# EAGLE design tC-mcu-adapter-rev1 (EAGLE 7.2.0)
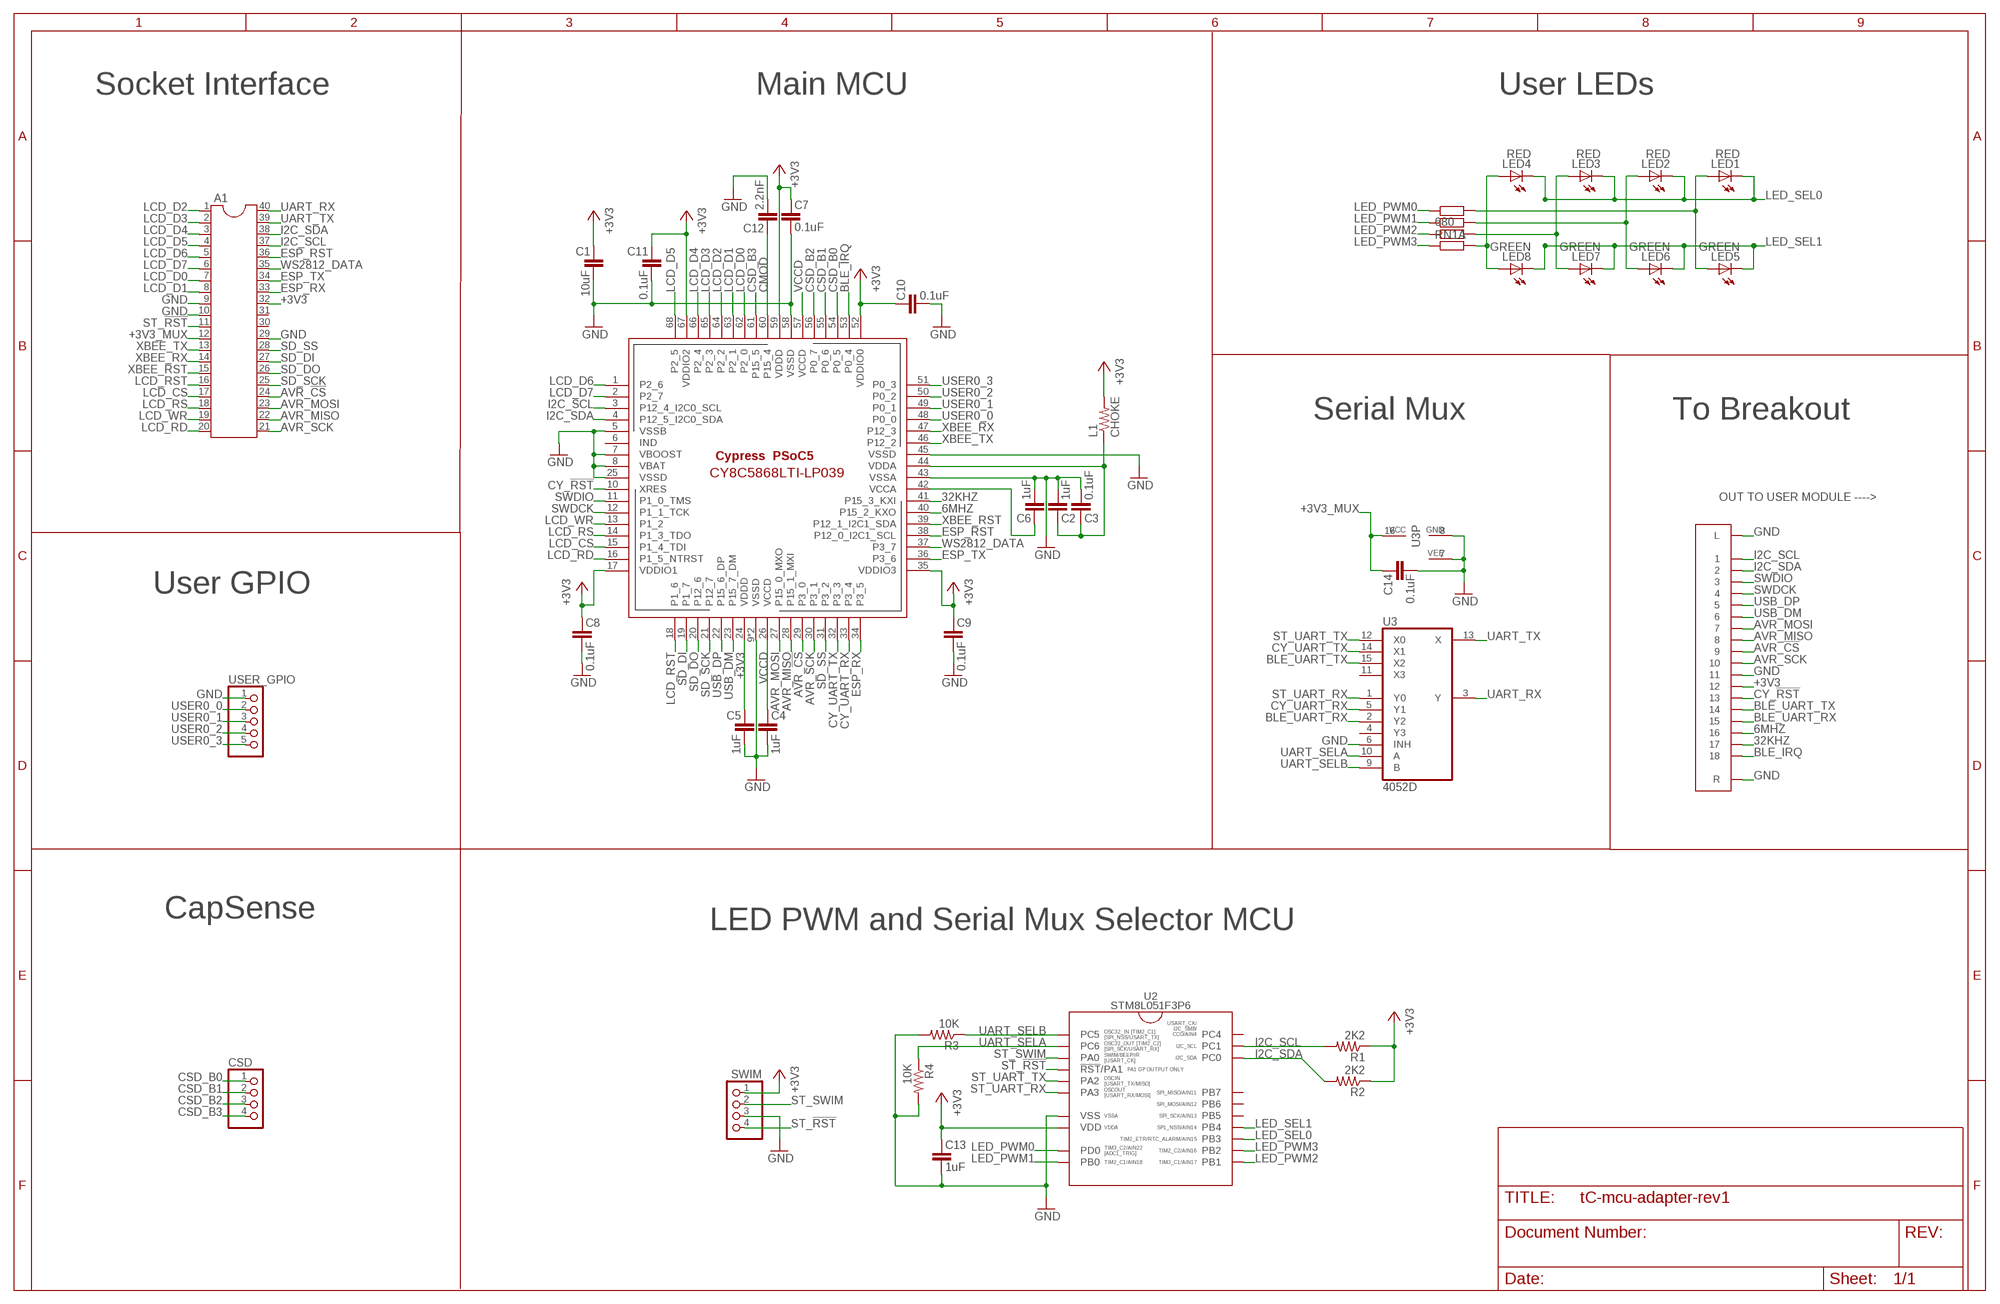
[diagram p0: schematic, sheet 1]

## Parts
A1  DIL40  [DIL40]
C1  10uF  C-EUC0805K  [C0805K]
C2  1uF  C-EUC0603K  [C0603K]
C3  0.1uF  C-EUC0603K  [C0603K]
C4  1uF  C-EUC0603K  [C0603K]
C5  1uF  C-EUC0603K  [C0603K]
C6  1uF  C-EUC0603K  [C0603K]
C7  0.1uF  C-EUC0603K  [C0603K]
C8  0.1uF  C-EUC0603K  [C0603K]
C9  0.1uF  C-EUC0603K  [C0603K]
C10  0.1uF  C-EUC0603K  [C0603K]
C11  0.1uF  C-EUC0603K  [C0603K]
C12  2.2nF  C-EUC0603K  [C0603K]
C13  1uF  C-EUC0402K  [C0402K]
C14  0.1uF  C-EUC0402K  [C0402K]
CN1  FPC_CONN_18PIN_0.5MM_SMT  [FPC_CONN_18PIN_0.5MM_SMT]
CSD  CAP_INTERCONNECT  [CAP_INTERCONNECT]
L1  CHOKE  R-US_R0805  [R0805]
LED1  RED  LED-0805  [LED-805]
LED2  RED  LED-0805  [LED-805]
LED3  RED  LED-0805  [LED-805]
LED4  RED  LED-0805  [LED-805]
LED5  GREEN  LED-0805  [LED-805]
LED6  GREEN  LED-0805  [LED-805]
LED7  GREEN  LED-0805  [LED-805]
LED8  GREEN  LED-0805  [LED-805]
R1  2K2  R-US_R0603  [R0603]
R2  2K2  R-US_R0603  [R0603]
R3  10K  R-US_R0603  [R0603]
R4  10K  R-US_R0603  [R0603]
RN1  680  RESISTOR_ARRAY_4  [RN8P-4R-CRA06S]
SWIM  PINHD-1X4  [1X04]
U1  CY8C5XXX-68-N  [QFN68N]
U2  STM8L051F3P6  [TSSOP20]
U3  4052D  [SO16]
USER_GPIO  PINHD-1X5/90  [1X05/90]

## Nets
6MHZ: CN1.16 U1.40(P15_2_KXO)
32KHZ: CN1.17 U1.41(P15_3_KXI)
+3V3: A1.32 C1.1 C5.1 C7.1 C8.1 C9.1 C10.1 C11.1 C13.1 CN1.12 L1.2 R1.1 R2.1 SWIM.1 U1.17(VDDIO1) U1.24(VDDD) U1.35(VDDIO3) U1.52(VDDIO0) U1.59(VDDD) U1.67(VDDIO2) U2.8(VDD)
+3V3_MUX: A1.12 C14.1 U3.16(VCC)
AVR_!CS: A1.24 CN1.9 U1.29(P3_0)
AVR_MISO: A1.22 CN1.8 U1.28(P15_1_MXI)
AVR_MOSI: A1.23 CN1.7 U1.27(P15_0_MXO)
AVR_SCK: A1.21 CN1.10 U1.30(P3_1)
BLE_IRQ: CN1.18 U1.53(P0_4)
BLE_UART_RX: CN1.15 U3.2(Y2)
BLE_UART_TX: CN1.14 U3.15(X2)
CMOD: C12.1 U1.60(P15_4)
CSD_B0: CSD.1 U1.54(P0_5)
CSD_B1: CSD.2 U1.55(P0_6)
CSD_B2: CSD.3 U1.56(P0_7)
CSD_B3: CSD.4 U1.61(P15_5)
CY_!RST: CN1.13 U1.10(XRES)
CY_UART_RX: U1.33(P3_4) U3.5(Y1)
CY_UART_TX: U1.32(P3_3) U3.14(X1)
ESP_RST: A1.36 U1.38(P12_0_I2C1_SCL)
ESP_RX: A1.33 U1.34(P3_5)
ESP_TX: A1.34 U1.36(P3_6)
GND: A1.9 A1.10 A1.29 C1.2 C2.2 C3.2 C4.2 C5.2 C6.2 C7.2 C8.2 C9.2 C10.2 C11.2 C12.2 C13.2 C14.2 CN1.11 CN1.GL(L) CN1.GR(R) R3.2 R4.2 SWIM.3 U1.5(VSSB) U1.7(VBOOST) U1.8(VBAT) U1.9(VSSD) U1.25(VSSD) U1.43(VSSA) U1.45(VSSD) U1.58(VSSD) U1.EPAD(VSSD) U2.7(VSS) U3.6(INH) U3.7(VEE) U3.8(GND) USER_GPIO.1
I2C_SCL: A1.37 CN1.1 R1.2 U1.3(P12_4_I2C0_SCL) U2.19(PC1)
I2C_SDA: A1.38 CN1.2 R2.2 U1.4(P12_5_I2C0_SDA) U2.18(PC0)
LCD_CS: A1.17 U1.15(P1_4_TDI)
LCD_D0: A1.7 U1.62(P2_0)
LCD_D1: A1.8 U1.63(P2_1)
LCD_D2: A1.1 U1.64(P2_2)
LCD_D3: A1.2 U1.65(P2_3)
LCD_D4: A1.3 U1.66(P2_4)
LCD_D5: A1.4 U1.68(P2_5)
LCD_D6: A1.5 U1.1(P2_6)
LCD_D7: A1.6 U1.2(P2_7)
LCD_RD: A1.20 U1.16(P1_5_NTRST)
LCD_RS: A1.18 U1.14(P1_3_TDO)
LCD_RST: A1.16 U1.18(P1_6)
LCD_WR: A1.19 U1.13(P1_2)
LED_PWM0: RN1.4 U2.9(PD0)
LED_PWM0R: LED1.A LED5.A RN1.5
LED_PWM1: RN1.3 U2.10(PB0)
LED_PWM1R: LED2.A LED6.A RN1.6
LED_PWM2: RN1.2 U2.11(PB1)
LED_PWM2R: LED3.A LED7.A RN1.7
LED_PWM3: RN1.1 U2.12(PB2)
LED_PWM3R: LED4.A LED8.A RN1.8
LED_SEL0: LED1.C LED2.C LED3.C LED4.C U2.13(PB3)
LED_SEL1: LED5.C LED6.C LED7.C LED8.C U2.14(PB4)
SD_DI: A1.27 U1.19(P1_7)
SD_DO: A1.26 U1.20(P12_6)
SD_SCK: A1.25 U1.21(P12_7)
SD_SS: A1.28 U1.31(P3_2)
ST_!RST: A1.11 SWIM.4 U2.4(!RST!/PA1)
ST_SWIM: SWIM.2 U2.3(PA0)
ST_UART_RX: U2.6(PA3) U3.1(Y0)
ST_UART_TX: U2.5(PA2) U3.12(X0)
SWDCK: CN1.4 U1.12(P1_1_TCK)
SWDIO: CN1.3 U1.11(P1_0_TMS)
UART_RX: A1.40 U3.3(Y)
UART_SELA: R4.1 U2.2(PC6) U3.10(A)
UART_SELB: R3.1 U2.1(PC5) U3.9(B)
UART_TX: A1.39 U3.13(X)
USB_DM: CN1.6 U1.23(P15_7_DM)
USB_DP: CN1.5 U1.22(P15_6_DP)
USER0_0: U1.48(P0_0) USER_GPIO.2
USER0_1: U1.49(P0_1) USER_GPIO.3
USER0_2: U1.50(P0_2) USER_GPIO.4
USER0_3: U1.51(P0_3) USER_GPIO.5
VCCA: C6.1 U1.42(VCCA)
VCCD: C4.1 U1.26(VCCD) U1.57(VCCD)
VDDA: C2.1 C3.1 L1.1 U1.44(VDDA)
WS2812_DATA: A1.35 U1.37(P3_7)
XBEE_RST: A1.15 U1.39(P12_1_I2C1_SDA)
XBEE_RX: A1.14 U1.47(P12_3)
XBEE_TX: A1.13 U1.46(P12_2)
Unconnected: A1.30 A1.31 U1.6(IND) U2.15(PB5) U2.16(PB6) U2.17(PB7) U2.20(PC4) U3.4(Y3) U3.11(X3)

## Notes on the sheet
- Socket Interface | Main MCU | User LEDs
- Serial Mux | To Breakout
- OUT TO USER MODULE ---->
- User GPIO
- CapSense
- LED PWM and Serial Mux Selector MCU

## Library data of the parts
A1 = _dc801:DIL40: Dual In Line
C1-C14 = rcl:C-EU: CAPACITOR, European symbol
CN1 = _dc801:FPC_CONN_18PIN
CSD = _dc801:CAP_INTERCONNECT
L1 R1-R4 = rcl:R-US_: RESISTOR, American symbol
LED1-LED8 = _wp_dc23:LED: Light Emitting Diode
RN1 = _dc801:RESISTOR_ARRAY_4: 4 Resistor Array 0603
SWIM = _dc801:PINHD-1X4: PIN HEADER
U1 = PatternAgents-Cypress:CY8C5XXX-68: Cypress PSoC® 5 - Programmable System on Chip, ARM Cortex-M3 Based Source Data: http://www.cypress.com/?mpn=CY8C5868LTI-LP038 PKG Source: http://www.cypress.com/?docID=38892 LBR Source: http://www.patternagents.com THIS SOFTWARE IS PROVIDED BY THE CONTRIBUTORS "AS IS" AND WITHOUT ANY EXPRESS OR IMPLIED WARRANTIES, INCLUDING, BUT NOT LIMITED TO, THE IMPLIED WARRANTIES OF MERCHANTABILITY AND FITNESS FOR A PARTICULAR PURPOSE ARE DISCLAIMED. IN NO EVENT SHALL THE COPYRIGHT OWNER OR CONTRIBUTORS BE LIABLE FOR ANY DIRECT, INDIRECT, INCIDENTAL, SPECIAL, EXEMPLARY, OR CONSEQUENTIAL DAMAGES (INCLUDING, BUT NOT LIMITED TO, PROCUREMENT OF SUBSTITUTE GOODS OR SERVICES; LOSS OF USE, DATA, OR PROFITS; OR BUSINESS INTERRUPTION) HOWEVER CAUSED AND ON ANY THEORY OF LIABILITY, WHETHER IN CONTRACT, STRICT LIABILITY, OR TORT (INCLUDING NEGLIGENCE OR OTHERWISE) ARISING IN ANY WAY OUT OF THE USE OF THIS SOFTWARE, EVEN IF ADVISED OF THE POSSIBILITY OF SUCH DAMAGE.
U2 = _wp_dc23:STM8L
U3 = 40xx:4052: Dual 4-channel ANALOG MULTIPLEXER
USER_GPIO = pinhead:PINHD-1X5: PIN HEADER

## Board
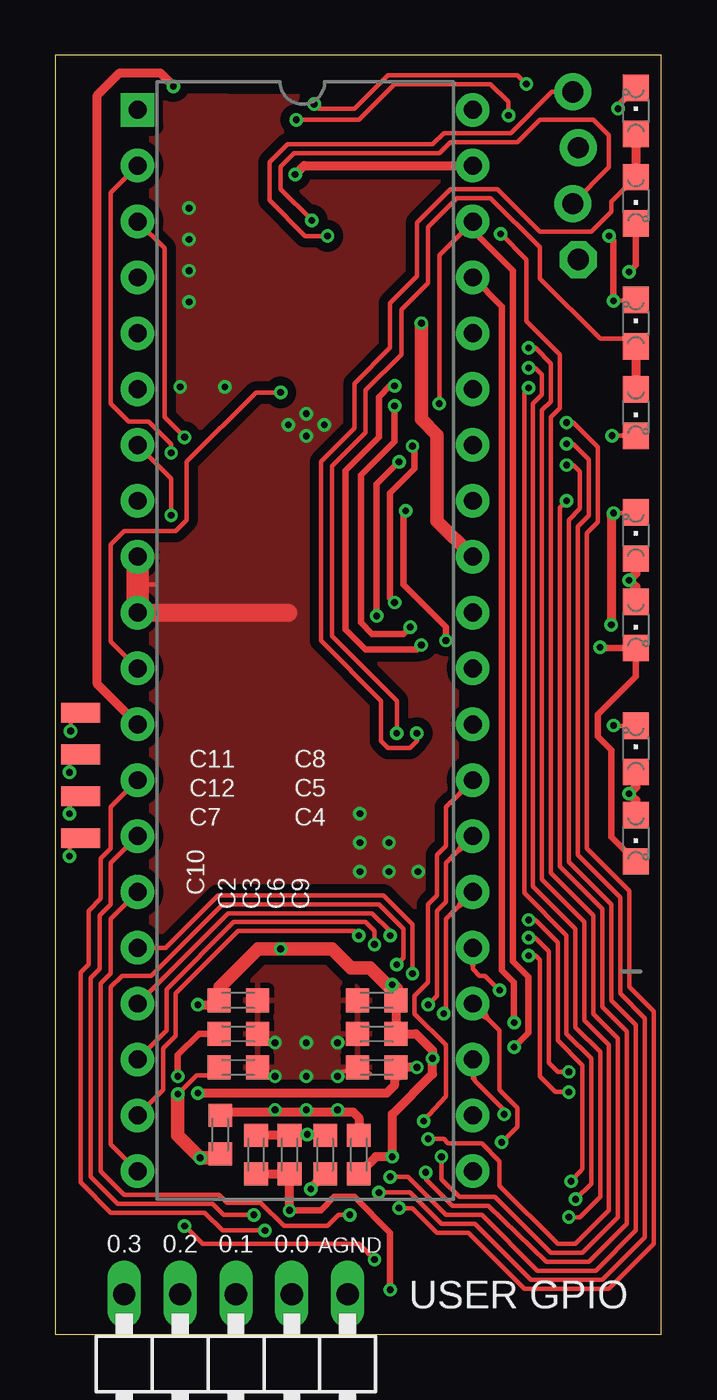
[diagram p1: board, top side]
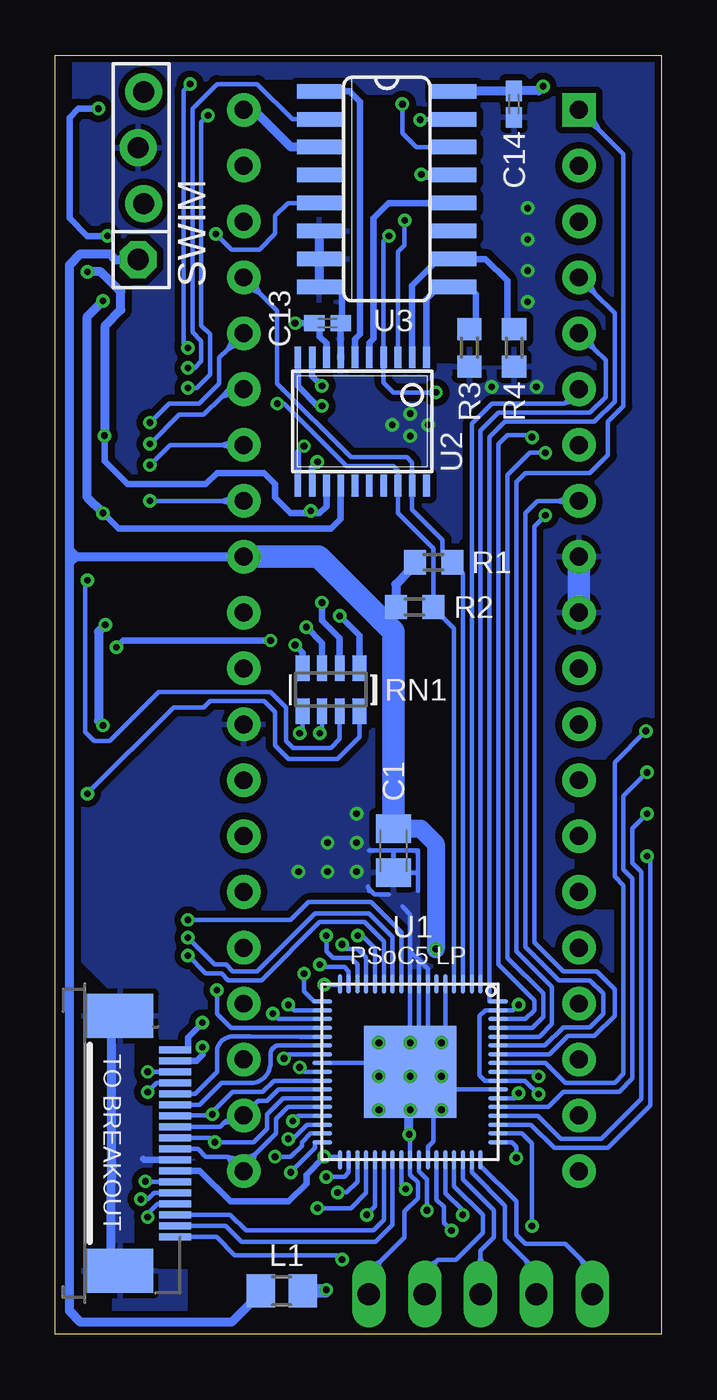
[diagram p2: board, bottom side, seen from below]

Size 27.58 x 58.17 mm. Coordinates in mm from the lower left corner, seen from the top.
Outline: 0,0 27.58,0 27.58,58.17 0,58.17 0,0
Copper layers (1*16): Top 0.035mm / dielectric 1.5mm / Bottom 0.035mm
Design rules "Elecrow2LAYER *": minimum track width 6mil, minimum drill 12mil, track to track 7mil, track to pad 7mil, pad to pad 6mil, via to via 6mil, smd to smd 0mil, copper to edge 10mil, drill to drill 10mil, minimum pad ring 10mil, minimum via ring 6mil, stop-mask expansion 2mil, vias tented up to drill 100mil, thermal gap 10mil
bRestrict: 20 lines

### Footprints (pad centres in the part's own frame; a part is rotated, then mirrored left to right if it is on the bottom)
DIL40 = drill 0.813 pad 1.524 square: 1 -24.13,-7.62 | drill 0.813 pad 1.524: 2 -21.59,-7.62; 3 -19.05,-7.62; 4 -16.51,-7.62; 5 -13.97,-7.62; 6 -11.43,-7.62; 7 -8.89,-7.62; 8 -6.35,-7.62; 9 -3.81,-7.62; 10 -1.27,-7.62; 11 1.27,-7.62; 12 3.81,-7.62; 13 6.35,-7.62; 14 8.89,-7.62; 15 11.43,-7.62; 16 13.97,-7.62; 17 16.51,-7.62; 18 19.05,-7.62; 19 21.59,-7.62; 20 24.13,-7.62; 21 24.13,7.62; 22 21.59,7.62; 23 19.05,7.62; 24 16.51,7.62; 25 13.97,7.62; 26 11.43,7.62; 27 8.89,7.62; 28 6.35,7.62; 29 3.81,7.62; 30 1.27,7.62; 31 -1.27,7.62; 32 -3.81,7.62; 33 -6.35,7.62; 34 -8.89,7.62; 35 -11.43,7.62; 36 -13.97,7.62; 37 -16.51,7.62; 38 -19.05,7.62; 39 -21.59,7.62; 40 -24.13,7.62
C0805K = smd 1.3 x 1.6: 1 -1,0; 2 1,0
C0603K = smd 1.05 x 1.08: 1 -0.875,0; 2 0.875,0
C0402K = smd 0.925 x 0.74: 1 -0.6,0; 2 0.6,0
FPC_CONN_18PIN_0.5MM_SMT = smd 0.3 x 1.45: 1 -4.25,4.1; 2 -3.75,4.1; 3 -3.25,4.1; 4 -2.75,4.1; 5 -2.25,4.1; 6 -1.75,4.1; 7 -1.25,4.1; 8 -0.75,4.1; 9 -0.25,4.1; 10 0.25,4.1; 11 0.75,4.1; 12 1.25,4.1; 13 1.75,4.1; 14 2.25,4.1; 15 2.75,4.1; 16 3.25,4.1; 17 3.75,4.1; 18 4.25,4.1 | smd 2 x 3: GL 5.8,1.6; GR -5.8,1.6
CAP_INTERCONNECT = smd 0.889 x 1.778: 1 0,0; 2 1.905,0; 3 3.81,0; 4 5.715,0
R0805 = smd 1.3 x 1.5: 1 -0.95,0; 2 0.95,0
LED-805 = smd 1.2 x 1.2: A 0,-1.05; C 0,1.05
R0603 = smd 1 x 1.1: 1 -0.85,0; 2 0.85,0
RN8P-4R-CRA06S = smd 0.63 x 1.15: 1 -1.295,-0.975; 4 1.295,-0.975; 5 1.295,0.975; 8 -1.295,0.975 | smd 0.44 x 1.15: 2 -0.4,-0.975; 3 0.4,-0.975; 6 0.4,0.975; 7 -0.4,0.975
1X04 = drill 0.965 pad 1.676 octagon: 1 -3.81,0.127 | drill 0.965 pad 1.676: 2 -1.27,-0.127; 3 1.27,0.127; 4 3.81,-0.127
QFN68N = smd 0.9 x 0.2: 1 -4,3.2; 2 -4,2.8; 3 -4,2.4; 4 -4,2; 5 -4,1.6; 6 -4,1.2; 7 -4,0.8; 8 -4,0.4; 9 -4,0; 10 -4,-0.4; 11 -4,-0.8; 12 -4,-1.2; 13 -4,-1.6; 14 -4,-2; 15 -4,-2.4; 16 -4,-2.8; 17 -4,-3.2; 35 4,-3.2; 36 4,-2.8; 37 4,-2.4; 38 4,-2; 39 4,-1.6; 40 4,-1.2; 41 4,-0.8; 42 4,-0.4; 43 4,0; 44 4,0.4; 45 4,0.8; 46 4,1.2; 47 4,1.6; 48 4,2; 49 4,2.4; 50 4,2.8; 51 4,3.2 | smd 0.2 x 0.9: 18 -3.2,-4; 19 -2.8,-4; 20 -2.4,-4; 21 -2,-4; 22 -1.6,-4; 23 -1.2,-4; 24 -0.8,-4; 25 -0.4,-4; 26 0,-4; 27 0.4,-4; 28 0.8,-4; 29 1.2,-4; 30 1.6,-4; 31 2,-4; 32 2.4,-4; 33 2.8,-4; 34 3.2,-4; 52 3.2,4; 53 2.8,4; 54 2.4,4; 55 2,4; 56 1.6,4; 57 1.2,4; 58 0.8,4; 59 0.4,4; 60 0,4; 61 -0.4,4; 62 -0.8,4; 63 -1.2,4; 64 -1.6,4; 65 -2,4; 66 -2.4,4; 67 -2.8,4; 68 -3.2,4 | smd 4.2 x 4.2: EPAD 0,0
TSSOP20 = smd 0.305 x 0.991: 1 -2.925,-2.918; 2 -2.275,-2.918; 3 -1.625,-2.918; 4 -0.975,-2.918; 5 -0.325,-2.918; 6 0.325,-2.918; 7 0.975,-2.918; 8 1.625,-2.918; 9 2.275,-2.918; 10 2.925,-2.918; 11 2.925,2.918; 12 2.275,2.918; 13 1.625,2.918; 14 0.975,2.918; 15 0.325,2.918; 16 -0.325,2.918; 17 -0.975,2.918; 18 -1.625,2.918; 19 -2.275,2.918; 20 -2.925,2.918
SO16 = smd 0.66 x 2.032: 1 -4.445,-3.073; 2 -3.175,-3.073; 3 -1.905,-3.073; 4 -0.635,-3.073; 5 0.635,-3.073; 6 1.905,-3.073; 7 3.175,-3.073; 8 4.445,-3.073; 9 4.445,3.073; 10 3.175,3.073; 11 1.905,3.073; 12 0.635,3.073; 13 -0.635,3.073; 14 -1.905,3.073; 15 -3.175,3.073; 16 -4.445,3.073
1X05/90 = drill 1.016 long: 1 -5.08,-3.81; 2 -2.54,-3.81; 3 0,-3.81; 4 2.54,-3.81; 5 5.08,-3.81

### Placement (x,y rotation side)
A1  11.38,31.55 270 top
C1  12.19,22 270 bottom
C2  9.14,8.18 90 top
C3  10.67,8.18 90 top
C4  14.63,12.14 180 top
C5  14.63,13.67 180 top
C6  12.29,8.18 90 top
C7  8.33,12.14 0 top
C8  14.63,15.19 180 top
C9  13.82,8.18 90 top
C10  7.52,9.09 90 top
C11  8.33,15.19 0 top
C12  8.33,13.67 0 top
C13  15.19,45.97 0 bottom
C14  6.72,55.93 270 bottom
CN1  26.21,8.69 270 bottom
CSD  1.17,22.56 90 top
L1  17.27,1.98 180 bottom
LED1  26.42,51.56 180 top
LED2  26.42,41.91 180 top
LED3  26.42,32.26 180 top
LED4  26.42,22.56 180 top
LED5  26.42,55.63 0 top
LED6  26.42,45.97 0 top
LED7  26.42,36.32 0 top
LED8  26.42,26.62 0 top
R1  10.36,35.1 0 bottom
R2  11.23,33.07 0 bottom
R3  8.74,44.86 270 bottom
R4  6.71,44.86 270 bottom
RN1  15.04,29.31 180 bottom
SWIM  23.67,52.68 90 bottom
U1  11.43,11.94 270 bottom
U2  13.61,41.5 180 bottom
U3  12.5,52.07 270 bottom
USER_GPIO  8.23,-1.98 180 top

### Tracks (layer width: path | path; a pad name or v marks a point on that pad's centre or on a via)
6MHZ
  Bottom 0.203: U1.40 12.63,5.2 13.11,4.72 18.9,4.72 19.61,5.44 CN1.16
32KHZ
  Bottom 0.203: U1.41 12.23,4.99 13.01,4.22 19.1,4.22 19.82,4.94 CN1.17
+3V3  (via drill 0.3)
  Top 0.203: v5.59,10.92 6.45,11.79 7.1,11.79 C7.1
  Top 0.406: 15.65,13.36 C5.1 | v6.5,14.99 7.33,14.99 C11.1 | C5.1 16.41,13.66 17.17,12.9 v17.17,12.55 | C8.1 C5.1 | 17.27,12.55 v17.17,12.55 | v17.17,12.55 17.17,11.84 15.34,10.01 v15.34,8.08 14.59,8.08 C9.1
  Top 0.61: C11.1 7.52,14.98 7.52,15.8 9.25,17.53 v10.26,17.53 12.6,17.53 13.46,16.66 14.33,16.66 15.09,15.9 v15.34,15.9 15.54,15.71 C8.1 | A1.32 17.37,36.98 17.37,40.89 16.66,41.6 v16.66,45.97 | v5.59,10.92 5.59,9.04 v6.6,8.03 7.53,8.03 C10.1
  Bottom 0.203: v15.34,15.9 14.63,15.9 U1.17 | U1.35 14.63,8.08 v15.34,8.08 | v6.5,14.99 6.75,14.74 U1.67 8.02,14.74 8.28,14.48 8.28,11.79 8.03,11.54 U1.59 6.2,11.54 v5.59,10.92 | U1.24 16.98,12.74 v17.17,12.55 | R2.1 12.65,32.5 12.65,32.41 | U1.52 6.81,8.74 6.6,8.53 v6.6,8.03
  Bottom 0.305: v15.34,8.08 16.15,7.26 16.15,6.86 16.97,6.04 19.61,6.04 21,7.44 CN1.12 | U2.8 15.24,45.06 15.54,45.36 15.54,45.63 C13.1 v16.66,45.97
  Bottom 0.406: L1.2 18.64,1.56 18.64,1.47 19.56,0.56 26.42,0.56 26.92,1.07 26.92,35.1 | 26.92,35.1 26.92,35.36 | 26.92,35.36 26.92,35.66 | 26.92,35.36 26.62,35.36 | 26.62,35.36 A1.32 | 26.62,35.36 26.92,35.66 | 26.62,35.36 26.92,35.1 | R1.1 11.48,34.73 11.48,34.7 12.08,34.1 R2.1 | 26.92,35.66 26.92,48.62 26.42,49.12 25.09,49.12 24.84,48.87 SWIM.1
  Bottom 0.813: C1.1 10.96,23 10.26,22.3 v10.26,17.53
  Bottom 1.016: C1.1 12.19,31.95 12.65,32.41 15.6,35.36 A1.32
+3V3_MUX  (via drill 0.3)
  Top 0.406: A1.12 1.93,29.57 1.93,56.34 2.95,57.35 4.78,57.35 v5.38,56.74
  Bottom 0.406: v5.38,56.74 5.6,56.53 C14.1 6.73,56.52 U3.16
AVR_!CS  (via drill 0.3)
  Top 0.203: 19.66,14.38 20.22,13.82 20.22,11.12 21.03,10.31 21.03,9.45 v20.32,8.74 | 19.66,14.38 A1.24 | 19.66,14.38 19.46,14.83 | 19.66,14.38 19.15,14.63
  Bottom 0.203: U1.29 17.2,10.74 17.93,10.01 17.93,9.35 18.54,8.74 v20.32,8.74 20.52,8.94 CN1.9
AVR_MISO
  Bottom 0.203: U1.28 17.41,11.14 17.93,10.62 18.34,10.62 A1.22 19.25,9.7 19.41,9.7 | 19.91,9.6 20.08,9.44 CN1.8 | 19.91,9.6 19.81,9.7 | 19.81,9.7 19.41,9.7 | 19.91,9.6 19.41,9.7 | 19.81,9.7 19.51,9.91
AVR_MOSI  (via drill 0.3)
  Top 0.203: A1.23 19,11.94 | 19,11.94 19,11.63 19.1,11.53 | v20.42,10.01 20.42,10.21 19.1,11.53 | 19.1,11.53 19,11.94
  Bottom 0.203: U1.27 17.62,11.54 18.14,11.02 19.51,11.02 20.42,10.11 v20.42,10.01 20.47,9.96 22.09,9.96 CN1.7
AVR_SCK
  Bottom 0.203: U1.30 16.99,10.34 17.53,9.8 17.53,9.14 18.49,8.18 | 18.49,8.18 19,7.67 A1.21 19.05,7.42 19.71,8.08 | 19.71,8.08 20.73,8.08 21.09,8.44 CN1.10 | 18.49,8.18 18.59,7.77 | 18.49,8.18 19,7.98 | 19.71,8.08 19.51,7.67 | 19.71,8.08 19.3,7.98
BLE_IRQ  (via drill 0.3)
  Top 0.203: v14.53,3.4 13.82,4.12 6.71,4.12 v5.89,4.93
  Bottom 0.203: 21.54,4.42 22.1,4.42 CN1.18 20.24,4.44 19.41,3.61 14.73,3.61 v14.53,3.4 | 6.95,9.14 U1.53 6.34,9.14 5.89,8.69 v5.89,4.93
BLE_UART_RX  (via drill 0.3)
  Top 0.203: v23.37,5.33 23.88,5.33 24.79,6.25 24.79,12.85 23.67,13.97 23.67,18.44 21.74,20.37 21.74,42.32 22.15,42.72 22.15,43.64 21.84,43.94 v21.54,43.94
  Bottom 0.203: v23.37,5.33 23.37,5.49 22.92,5.94 CN1.15 | v21.54,43.94 21.23,43.94 20.93,44.25 20.93,45.16 21.34,45.57 21.34,55.73 20.22,56.84 18.39,56.84 16.79,55.24 U3.2
BLE_UART_TX  (via drill 0.3)
  Top 0.203: v23.67,6.15 24.38,6.86 24.38,12.55 23.27,13.66 23.27,18.14 21.34,20.07 21.34,42.82 v21.54,43.03 | v20.62,55.42 20.62,56.03 19.81,56.84 15.44,56.84 13.82,55.22 v10.97,55.22
  Bottom 0.203: v23.67,6.15 23.37,6.15 23.08,6.44 CN1.14 | v21.54,43.03 21.13,43.03 20.52,43.64 20.52,45.47 20.93,45.87 20.93,55.12 v20.62,55.42 | v10.97,55.22 10.95,55.24 U3.15
CMOD  (via drill 0.3)
  Top 0.305: v5.59,11.73 5.59,12.7 6.55,13.66 C12.1
  Top 0.406: 7.21,13.36 C12.1
  Bottom 0.203: v5.59,11.73 5.79,11.94 U1.60
CSD_B0  (via drill 0.3 pad 0.25)
  Top 0.203: 0.51,22.35 0.61,22.45 0.66,22.45 | 1.07,22.45 CSD.1 0.66,22.55 0.66,22.45 | v0.66,21.74 0.66,22.45
  Bottom 0.203: U1.54 5.93,9.54 4.88,8.48 2.44,8.48 0.51,10.41 0.51,21.59 v0.66,21.74
CSD_B1  (via drill 0.3)
  Top 0.203: v0.66,23.67 0.66,24.46 CSD.2
  Bottom 0.203: U1.55 5.62,9.94 4.57,8.89 2.74,8.89 0.91,10.72 0.91,21.03 1.32,21.44 1.32,23.01 v0.66,23.67
CSD_B2  (via drill 0.3)
  Top 0.203: v0.66,25.55 0.66,26.36 CSD.3
  Bottom 0.203: U1.56 5.16,10.34 4.47,11.02 1.93,11.02 1.32,11.63 1.32,20.73 1.73,21.13 1.73,24.49 v0.66,25.55
CSD_B3  (via drill 0.3)
  Top 0.203: v0.71,27.43 0.71,28.27 CSD.4
  Bottom 0.203: U1.61 5.28,12.34 4.37,11.43 2.13,11.43 1.73,11.84 1.73,20.42 2.13,20.83 2.13,26.01 v0.71,27.43
CY_!RST  (via drill 0.3)
  Top 0.203: v23.47,6.96 23.93,7.47 23.98,7.52 23.98,12.24 22.86,13.36 22.86,17.83 21.84,18.85 v21.54,18.85
  Bottom 0.203: v21.54,18.85 16.87,18.85 16.05,19.66 13.21,19.66 11.83,18.28 U1.10 | v23.47,6.96 23.45,6.94 CN1.13
CY_UART_RX  (via drill 0.3)
  Top 0.203: v17.58,8.08 17.58,7.06 18.39,6.25 20.02,6.25 22.55,3.71 23.98,3.71 25.6,5.33 25.6,13.46 24.49,14.58 24.49,19.05 22.55,20.98 22.55,41.71 22.96,42.11 22.96,44.55 21.44,46.08 21.44,48.87 v20.27,50.04
  Bottom 0.203: U1.33 15.96,9.14 16.36,8.74 16.36,8.59 16.87,8.08 v17.58,8.08 | v20.27,50.04 19.56,49.33 18.29,49.33 17.58,50.04 17.58,50.85 16.99,51.44 U3.5
CY_UART_TX  (via drill 0.3)
  Top 0.203: v16.97,8.89 17.68,8.89 17.88,8.69 19.41,8.69 20.22,7.87 20.22,6.76 22.86,4.12 23.67,4.12 25.2,5.64 25.2,13.16 24.08,14.28 24.08,18.75 22.15,20.68 22.15,42.01 22.55,42.42 22.55,44.15 21.84,44.86 v21.54,44.86 | v11.79,55.93 11.99,55.73 13.61,55.73 15.14,57.25 21.03,57.25 v21.44,56.84
  Bottom 0.203: U1.32 16.12,9.54 16.76,8.89 v16.97,8.89 | U3.14 11.15,53.98 11.79,54.61 v11.79,55.93 | v21.44,56.84 21.74,56.54 21.74,45.06 v21.54,44.86
ESP_RST  (via drill 0.3)
  Top 0.203: v15.65,5.74 16.26,5.74 17.37,4.62 18.8,4.62 21.34,2.08 25.2,2.08 27.23,4.12 27.23,14.68 26.11,15.8 26.11,20.17 24.18,22.1 24.18,36.42 24.69,36.93 24.69,40.34 23.57,41.45 v23.27,41.45
  Bottom 0.203: U1.38 13.43,6.43 14.12,5.74 v15.65,5.74 | A1.36 19.71,44.81 | 19.71,44.81 20.12,44.4 20.12,43.23 21.03,42.32 22.4,42.32 v23.27,41.45 | 19.71,44.81 19.46,45.31 | 19.71,44.81 19.2,45.06
ESP_RX  (via drill 0.3)
  Top 0.203: v23.27,37.9 22.96,37.59 22.96,21.29 24.89,19.36 24.89,14.88 26.01,13.77 26.01,5.03 24.28,3.3 22.35,3.3 19.71,5.84 18.09,5.84 16.87,7.06 v16.87,7.37
  Bottom 0.203: U1.34 15.7,8.74 15.75,8.69 15.75,8.48 v16.87,7.37 | v23.27,37.9 20.02,37.9 | 20.02,37.9 A1.33 | 20.02,37.9 19.51,38.05 | 20.02,37.9 19.51,37.74
ESP_TX  (via drill 0.3)
  Top 0.203: v15.24,7.16 16.05,7.16 17.78,5.44 19.41,5.44 21.95,2.9 24.59,2.9 26.42,4.72 26.42,14.07 25.3,15.19 25.3,19.56 23.37,21.49 23.37,37.03 23.88,37.54 23.88,39.22 23.57,39.52 v23.27,39.52
  Bottom 0.203: U1.36 14.23,7.36 14.43,7.16 v15.24,7.16 | v23.27,39.52 22.35,40.44 20.02,40.44 | 20.02,40.44 A1.34 | 20.02,40.44 19.51,40.59 | 20.02,40.44 19.51,40.28
GND  (via drill 0.3)
  Top 0.203: 14.33,11.84 C4.2 12.75,11.84 v12.85,11.73 | v12.85,10.21 12.85,10.16 12.9,10.11 | 3.76,34.09 4.57,34.09
  Top 0.406: C2.2 C3.2 v11.47,9.08 v11.48,9.09 12.28,9.09 | 7.57,10.26 7.72,10.11 12.9,10.11 13.56,10.11 13.82,9.86 C9.2
  Top 0.61: C10.2 7.72,10.11 | 12.28,9.09 C6.2
  Top 0.813: A1.10 10.62,32.82
  Top 1.016: A1.10 3.76,34.09 3.76,35.31
  Bottom 0.203: U1.58 10.36,11.14 | 10.36,11.14 10.57,11.14 | 10.57,11.14 10.63,11.14 11.05,11.56 U1.EPAD | v11.48,9.09 11.43,9.14 U1.43 11.43,7.26 11.07,6.91 11.07,6.2 11.68,5.59 11.68,4.42 12.8,3.3 | U1.EPAD 11.83,12.34 U1.25 11.94,12.34 v11.43,13.26 | 9.55,10.62 9.55,10.12 10.57,11.14 | v11.43,13.26 U1.9 11.43,17.42 | v11.43,13.26 U1.EPAD | 11.03,12.34 U1.EPAD | 10.31,12.29 11.23,11.38 | U1.5 9.83,12.78 10.31,12.29 | 10.36,11.14 10.21,10.99 v10.01,10.21 10.36,9.86 10.36,8.79 10.63,8.52 U1.45 | v11.43,10.21 11.43,11.18 11.38,11.23 | 11.48,10.92 12.19,10.21 v12.85,10.21 | U1.EPAD v11.43,11.73 | v10.01,11.73 10.26,11.79 10.26,11.84 10.36,11.94 U1.EPAD | U1.EPAD 12.45,11.94 v12.85,11.73 v12.85,13.26 | v10.01,13.26 10.31,12.75 10.31,12.29 | 11.43,17.42 11.43,19.1 11.79,19.46 | 11.03,17.02 10.63,16.62 U1.7 10.63,13.2 10.67,13.16 | 11.03,17.02 11.43,17.42 | 11.03,17.02 U1.8 11.03,13.32 10.97,13.26 | 12.8,3.3 13.31,2.79 USER_GPIO.1 | 11.07,20.17 11.07,20.98 | 11.07,20.98 12.19,20.98 12.19,22 | 11.07,20.98 11.07,22 12.19,22 | 12.19,22 13.31,22 | 12.39,20.02 13.06,20.02 13.21,20.17 | 13.21,20.17 13.31,20.17 | 13.21,20.17 13.36,20.32 13.36,20.37 | 12.8,3.3 12.9,3 | 12.8,3.3 13.21,3.1
  Bottom 0.305: U2.7 14.59,45.62 C13.2 14.53,46.03 14.53,47.3 14.86,47.62 U3.8 | 25,6.94 25.02,6.96 | 24.97,7.26 25,7.29 | 24.89,7.67 25,7.77 | CN1.11 23.53,7.94 23.57,7.98
  Bottom 0.406: v11.48,9.09 11.48,10.92 | 25.02,14.89 CN1.GR 25,14.1 25,7.77 25,7.39 25,7.29 25.02,6.96 25.02,3.29 CN1.GL | U3.8 U3.7 U3.6
  Bottom 0.61: 11.48,10.92 11.48,11.12 11.38,11.23 11.23,11.38 11.05,11.56
  Bottom 1.016: A1.9 A1.10
  other vias: 13.87,21.03 15.19,21.03 16.51,21.03 7.72,43.08 6.1,46.94 6.1,48.36 6.1,49.78 6.1,51.21 11.43,41.86 12.24,41.35 13.87,22.35 13.87,23.67 15.19,22.35 11.43,40.84 10.62,41.35 5.69,43.08
  pour Bottom (isolate 0.305): 9.65,16.21 9.65,35.71 8.84,36.53 8.84,41.5 7.82,42.52 5.59,42.52 5.69,16.41 0.2,16.41 0.2,57.96 26.72,57.96 26.72,46.99 26.62,16.21
  pour Top (isolate 0.406): 8.64,11.53 8.64,16.41 9.45,17.22 12.29,17.22 13.92,15.6 14.33,15.6 14.33,11.53
  pour Top (isolate 0.406): 4.37,16.71 4.37,56.34 18.29,56.24 18.29,16.41 14.33,16.41 12.7,18.03 9.04,18.03 6.5,15.49 5.59,15.49
  pour Bottom (isolate 0.305): 20.62,16.31 20.32,16 20.32,8.89 21.64,7.57 21.64,0.86 26.21,0.86 26.62,1.27 26.62,15.7 26.01,16.31
I2C_SCL  (via drill 0.3)
  Top 0.305: v20.88,14.17 20.88,16 20.32,16.56 20.32,46.74 A1.37
  Bottom 0.203: U1.3 9.03,34.58 9.51,35.07 R1.2 | 18.29,47.35 17.48,46.53 17.48,43.23 14.12,39.88 11.58,39.88 11.34,39.63 U2.19 11.34,37.5 9.96,36.12 9.96,35.55 R1.2 | 18.29,47.35 A1.37 | 9.56,35.05 R1.2 | 9.51,35 R1.2 | 9.62,35.1 R1.2 | 18.29,47.35 18.54,47.85 | 18.29,47.35 18.8,47.6
  Bottom 0.305: v20.88,14.17 21.54,13.51 21.54,13.06 21.66,12.94 CN1.1
I2C_SDA  (via drill 0.3)
  Top 0.203: v17.48,42.32 17.48,49.07 A1.38
  Top 0.305: A1.38 19,50.19 20.83,48.36 20.83,16.97 21.54,16.26 21.54,13.72 v20.88,13.06
  Bottom 0.203: U1.4 9.43,32.09 10.38,33.03 R2.2 10.38,35.73 11.99,37.34 U2.18 11.99,39.27 12.19,39.47 14.33,39.47 17.17,42.32 v17.48,42.32
  Bottom 0.305: v20.88,13.06 20.88,12.7 21.14,12.44 CN1.2
LCD_CS  (via drill 0.3)
  Top 0.203: A1.17 7.87,19.15 14.43,19.15 15.24,18.34 v15.24,18.14
  Bottom 0.203: v15.24,18.14 15.24,17.42 14.94,17.12 14.12,17.12 13.83,16.83 U1.15
LCD_D0  (via drill 0.3)
  Top 0.203: A1.7 5.28,38.91 v5.28,37.24
  Bottom 0.203: U1.62 5.09,12.74 4.27,13.56 3.05,13.56 2.13,14.48 2.13,15.7 2.95,16.51 4.47,16.51 5.79,17.83 5.79,36.73 v5.28,37.24
LCD_D1
  Bottom 0.203: U1.63 5.3,13.14 4.47,13.97 3.25,13.97 2.64,14.58 2.64,15.49 3.25,16.1 4.67,16.1 6.2,17.63 6.2,37.34 5.64,37.9 4.72,37.9 | 4.72,37.9 A1.8 | 4.72,37.9 4.27,38.05 | 4.72,37.9 4.27,37.74
LCD_D2
  Bottom 0.203: U1.64 5.56,13.54 4.98,14.12 4.98,15.8 6.6,17.42 6.6,38.76 6.2,39.17 3.25,39.17 2.44,39.98 2.44,41.5 1.73,42.22 1.73,53.65 2.85,54.76 | 2.85,54.76 A1.1 | 2.85,54.76 3.15,55.32 | 2.85,54.76 3.35,55.12
LCD_D3  (via drill 0.3)
  Top 0.203: v5.28,40.08 5.28,40.49 4.27,41.5 3.35,41.5 2.54,42.32 2.54,51.92 A1.2
  Bottom 0.203: U1.65 5.87,13.94 5.38,14.43 5.38,15.49 7.01,17.12 7.01,39.06 5.99,40.08 v5.28,40.08
LCD_D4  (via drill 0.3)
  Top 0.203: v5.89,40.79 4.98,41.71 4.98,49.38 A1.3
  Bottom 0.203: U1.66 6.18,14.34 5.79,14.73 5.79,15.19 7.42,16.82 7.42,40.49 7.01,40.89 5.99,40.89 v5.89,40.79
LCD_D5
  Bottom 0.203: U1.68 7.82,15.14 7.82,40.79 7.11,41.5 3.05,41.5 2.13,42.42 2.13,46.43 3.05,47.35 | 3.05,47.35 A1.4 | 3.05,47.35 3.3,47.85 | 3.05,47.35 3.56,47.65
LCD_D6
  Bottom 0.203: 3.05,44.81 2.54,44.3 2.54,42.62 3.25,41.91 7.42,41.91 8.23,41.1 U1.1 | 3.05,44.81 3.1,44.86 | 3.1,44.86 A1.5 | 3.1,44.86 3.3,45.26 | 3.05,44.81 3.5,45.06
LCD_D7
  Bottom 0.203: 4.42,42.32 7.72,42.32 8.63,41.41 U1.2 | 4.42,42.32 A1.6 | 4.42,42.32 3.96,42.47
LCD_RD  (via drill 0.3)
  Top 0.203: v15.54,16.82 15.85,17.12 15.85,18.44 14.73,19.56 7.62,19.56 4.37,16.31 3.05,16.31 2.54,15.8 2.54,8.64 A1.20
  Bottom 0.203: U1.16 14.23,16.52 14.43,16.71 15.44,16.71 v15.54,16.82
LCD_RS  (via drill 0.3)
  Top 0.203: A1.18 5.08,13.82 5.08,15.7 8.13,18.75 14.12,18.75 14.53,18.34 v14.53,17.73
  Bottom 0.203: U1.14 13.43,17.14 13.82,17.53 14.33,17.53 v14.53,17.73
LCD_RST  (via drill 0.3)
  Top 0.203: A1.16 5.03,17.58 7.42,19.96 14.94,19.96 16.26,18.64 v16.26,16.41
  Bottom 0.203: U1.18 15.8,15.14 16.26,15.6 v16.26,16.41
LCD_WR  (via drill 0.3)
  Top 0.203: A1.19 4.93,11.12 4.93,13.01 5.49,13.56 5.49,15.49 8.33,18.34 13.61,18.34 v13.82,18.14
  Bottom 0.203: U1.13 13.03,17.55 13.61,18.14 v13.82,18.14
LED_PWM0  (via drill 0.3)
  Top 0.305: v15.44,43.13 15.24,43.13 14.73,42.62 14.73,40.79 13.21,39.27 13.21,32.05 14.12,31.14 16.46,31.14 v16.66,31.34
  Bottom 0.305: U2.9 15.89,43.58 v15.44,43.13 | v16.66,31.34 16.33,31.01 RN1.4
LED_PWM0R  (via drill 0.3)
  Top 0.203: LED1.A 25.3,51.49 25.3,51.05 24.38,50.14 22.05,50.14 20.12,52.07 17.98,52.07 16.46,50.55 16.46,48.11 15.24,46.89 15.24,44.86 13.61,43.23 13.61,41.2 12.09,39.67 12.09,31.55 14.83,28.8 14.83,26.98 15.14,26.67 16.15,26.67 16.46,26.98 v16.46,27.33
  Top 0.406: LED5.A LED1.A
  Bottom 0.203: v16.46,27.33 16.43,27.3 16.33,27.41 RN1.5
LED_PWM1  (via drill 0.3)
  Top 0.305: v15.44,42.22 15.44,40.59 13.92,39.06 13.92,32.36 14.43,31.85 15.85,31.85 v16.15,32.16
  Bottom 0.305: U2.10 16.54,43.11 15.65,42.22 v15.44,42.22 | v16.15,32.16 15.44,31.44 RN1.3
LED_PWM1R  (via drill 0.3)
  Top 0.203: LED6.A 26.42,45.01 26.16,45.26 24.79,45.26 22.05,48.01 22.05,49.43 19.81,51.66 18.29,51.66 16.97,50.34 16.97,47.8 15.75,46.58 15.75,44.55 14.12,42.93 14.12,41 12.6,39.47 12.6,31.75 15.54,28.8 v15.54,27.33
  Top 0.406: LED6.A LED2.A
  Bottom 0.203: v15.54,27.33 15.54,27.39 15.44,27.49 RN1.6
LED_PWM2  (via drill 0.3)
  Top 0.305: v16.26,40.39 16.36,40.28 16.36,39.37 15.24,38.25 15.24,33.48 v15.44,33.27
  Bottom 0.305: U2.11 16.54,40.1 v16.26,40.39 | RN1.2 14.64,31.66 15.44,32.46 v15.44,33.27
LED_PWM2R  (via drill 0.3)
  Top 0.406: LED3.A 26.42,33.98 v26.11,34.29 26.42,34.59 LED7.A
  Bottom 0.203: RN1.7 14.64,27.07 15.04,26.67 16.76,26.67 17.07,26.98 17.07,28.5 17.78,29.21 22.86,29.21 25.09,26.98 25.81,26.98 26.21,27.38 26.21,34.19 v26.11,34.29
LED_PWM3  (via drill 0.3)
  Top 0.305: v14.63,32.66 14.63,38.66 v15.65,39.67
  Bottom 0.305: U2.12 15.89,39.43 v15.65,39.67 | RN1.1 13.74,31.78 v14.63,32.66
LED_PWM3R  (via drill 0.3)
  Top 0.406: LED4.A 26.42,24.28 v26.11,24.59 26.42,24.89 LED8.A
  Bottom 0.203: RN1.8 13.74,27.15 14.73,26.16 16.97,26.16 17.58,26.77 17.58,28.3 18.09,28.8 20.52,28.8 20.83,28.5 22.2,28.5 v26.11,24.59
LED_SEL0  (via drill 0.3)
  Top 0.203: 25.3,22.61 25.32,22.61 LED4.C | v25.33,40.86 LED2.C
  Top 0.305: v26.11,48.31 26.42,48.62 LED1.C | LED4.C 25.3,22.62 25.3,26.57 24.69,27.18 24.69,28.19 26.42,29.92 LED3.C 24.82,31.21 v24.79,31.24 | v15.95,37.44 15.85,37.34 15.85,34.09 17.78,32.16 v17.78,31.55
  Bottom 0.203: 15.54,37.34 15.85,37.34 v15.95,37.44 | v25.33,40.86 25.3,40.89
  Bottom 0.305: U2.13 15.24,37.64 15.54,37.34 16.87,37.34 17.58,38.05 17.58,38.66 18.09,39.17 20.22,39.17 20.73,38.66 24.28,38.66 25.33,39.71 v25.33,40.86 | v17.78,31.55 24.49,31.55 v24.79,31.24
  Bottom 0.406: 25.3,40.89 25.3,45.87 24.59,46.58 24.59,47.4 25.5,48.31 v26.11,48.31
LED_SEL1  (via drill 0.3)
  Top 0.203: LED6.C 26.38,46.99 v25.4,46.99 | LED7.C 26.38,37.34 v25.4,37.34 | LED8.C 25.42,27.67 v25.4,27.69
  Top 0.305: v25.4,46.99 25.4,49.73 v25.2,49.94 | v25.6,55.73 25.6,55.86 LED5.C
  Top 0.406: v25.4,37.34 25.3,37.24 v25.3,32.26
  Bottom 0.305: U2.14 14.59,37.07 15.04,36.63 24.69,36.63 v25.4,37.34 | v25.2,49.94 26.11,49.94 26.92,50.75 26.92,55.32 26.52,55.73 v25.6,55.73
  Bottom 0.406: v25.4,37.34 26.11,38.05 26.11,46.28 v25.4,46.99 | v25.3,32.26 25.6,31.95 25.6,27.89 v25.4,27.69
SD_DI  (via drill 0.3)
  Top 0.203: A1.27 18.29,21.95 | 18.29,21.95 17.78,21.44 17.78,19.66 17.37,19.25 17.37,15.39 v16.97,14.99 | 18.29,21.95 18.59,22.45 | 18.29,21.95 18.8,22.25
  Bottom 0.203: v16.97,14.99 16.72,14.74 U1.19
SD_DO  (via drill 0.3)
  Top 0.203: A1.26 18.34,19.46 | 18.34,19.46 17.78,18.9 17.78,14.68 v17.68,14.58 | 18.34,19.46 18.59,19.91 | 18.34,19.46 18.8,19.71
  Bottom 0.203: U1.20 17.44,14.34 v17.68,14.58
SD_SCK  (via drill 0.3)
  Top 0.203: v20.22,15.65 19.56,16.31 19.3,16.31 19,16.61 19,16.71 | 19,16.71 A1.25 | 19,16.71 19.1,17.12 | 19,16.71 18.9,17.12
  Bottom 0.203: U1.21 19.58,13.94 20.22,14.58 v20.22,15.65
SD_SS  (via drill 0.3)
  Top 0.203: v16.76,9.7 17.78,10.82 17.78,13.16 16.36,14.58 16.36,15.39 16.97,16 16.97,19.56 17.37,19.96 17.37,21.79 17.78,22.2 17.78,23.98 18.34,24.54 | 18.34,24.54 A1.28 | 18.34,24.54 18.8,24.84 | 18.34,24.54 18.64,24.99
  Bottom 0.203: U1.31 16.53,9.94 v16.76,9.7
ST_!RST  (via drill 0.3)
  Top 0.203: A1.11 2.54,31.5 2.54,35.92 3.15,36.52 5.49,36.52 5.99,37.03 5.99,39.67 9.14,42.82 v10.26,42.82 | v12.39,49.94 11.38,49.94 9.75,51.56 9.75,53.29 10.57,54.1 17.17,54.1 17.68,54.61 20.73,54.61 22.61,56.49 SWIM.4
  Bottom 0.203: v12.39,49.94 12.64,49.69 U2.4 12.64,43.27 12.19,42.82 v10.26,42.82
ST_SWIM  (via drill 0.3)
  Top 0.203: v11.68,50.65 10.26,52.07 10.26,53.09 10.87,53.7 17.48,53.7 17.98,54.2 21.03,54.2 22.05,55.22 24.49,55.22 25.2,54.51 25.2,53.06 SWIM.2
  Bottom 0.203: v11.68,50.65 11.68,49.53 11.99,49.23 U2.3
ST_UART_RX
  Bottom 0.305: U2.6 13.94,45.24 13.72,45.47 13.72,56.03 14.2,56.52 U3.1
ST_UART_TX
  Bottom 0.305: U2.5 13.29,45.08 13.11,45.26 13.11,50.75 12.42,51.44 U3.12
SWDCK  (via drill 0.3)
  Top 0.203: v23.37,11.02 22.76,11.02 22.05,11.73 22.05,17.02 21.84,17.22 v21.54,17.22
  Bottom 0.203: U1.12 12.63,17.86 13.51,18.75 15.54,18.75 18.19,16.1 19.71,16.1 20.02,16.41 20.73,16.41 v21.54,17.22 | CN1.4 22.95,11.44 v23.37,11.02
SWDIO  (via drill 0.3)
  Top 0.203: v23.37,11.94 22.86,11.94 22.45,12.34 22.45,17.42 21.84,18.03 v21.54,18.03
  Bottom 0.203: U1.11 12.23,18.07 13.31,19.15 15.75,19.15 18.39,16.51 19.51,16.51 19.81,16.82 20.32,16.82 v21.54,18.03 | CN1.3 v23.37,11.94
UART_RX
  Bottom 0.406: U3.3 16.84,53.98 18.54,55.68 A1.40
UART_SELA
  Bottom 0.305: U2.2 11.34,47.69 10.13,48.9 U3.10 8,48.9 7.01,47.9 7.01,46.01 R4.1
UART_SELB
  Bottom 0.305: U2.1 10.69,47.07 10.06,47.7 9.5,47.7 U3.9 8.76,47.62 8.43,47.3 8.43,46.01 R3.1
UART_TX  (via drill 0.3)
  Top 0.406: v10.92,52.73 11.33,53.14 A1.39
  Bottom 0.406: v10.92,52.73 10.9,52.7 U3.13
USB_DM
  Bottom 0.203: U1.23 17.39,13.14 arc-90 17.78,12.75 17.78,12.34 arc90 18.69,11.43 20.02,11.43 21.01,10.44 CN1.6
USB_DP
  Bottom 0.203: U1.22 16.43,13.54 18.69,13.55 19.46,13.55 arc-90 20.22,12.85 20.22,11.94 21.22,10.94 CN1.5
USER0_0
  Bottom 0.203: 10.26,3.3 10.16,3.4 9.35,3.4 8.13,4.62 8.13,5.44 9.43,6.74 U1.48 | 10.26,3.3 10.77,2.79 USER_GPIO.2 | 10.26,3.3 10.46,2.9 | 10.26,3.3 10.67,3.1
USER0_1
  Bottom 0.203: 8.23,3.5 8.23,3.81 7.62,4.42 7.62,5.64 9.03,7.05 U1.49 | 8.23,3.5 USER_GPIO.3 | 8.23,3.5 8.13,3.1 | 8.23,3.5 8.33,3.1
USER0_2
  Bottom 0.203: 6.2,3.4 7.11,4.32 7.11,5.84 8.63,7.36 U1.50 | 6.2,3.4 5.69,2.9 USER_GPIO.4 | 6.2,3.4 5.99,3
USER0_3
  Bottom 0.203: 3.15,2.39 USER_GPIO.5 3.15,2.9 3.66,3.4 | 3.66,3.4 4.37,4.12 6.2,4.12 6.6,4.52 6.6,6.04 8.23,7.67 U1.51 | 3.66,3.4 3.45,3
VCCA  (via drill 0.3)
  Top 0.406: v11.63,6.6 11.63,6.64 C6.1
  Bottom 0.203: U1.42 11.83,6.8 v11.63,6.6
VCCD  (via drill 0.3)
  Top 0.203: C4.1 15.53,11.83 15.43,11.83
  Top 0.406: v6.5,10.97 15.09,10.97 15.43,11.31 15.43,11.83 | 15.64,11.73 C4.1 v16.46,12.14
  Bottom 0.203: U1.57 6.69,10.74 v6.5,10.97 | U1.26 16.26,11.94 v16.46,12.14
VDDA  (via drill 0.3)
  Top 0.305: v10.67,5.64 12.09,5.64 12.7,6.25 13.61,6.25 15.24,4.62 v15.24,2.03
  Top 0.406: C2.1 C3.1 v10.67,5.64
  Bottom 0.203: U1.44 11.03,7.42 10.67,7.06 v10.67,5.64
  Bottom 0.305: 16.26,1.98 L1.1
  Bottom 0.61: v15.24,2.03 15.29,1.98 L1.1
WS2812_DATA  (via drill 0.3)
  Top 0.203: v14.73,6.45 16.15,6.45 17.58,5.03 19.1,5.03 21.64,2.49 24.89,2.49 26.82,4.42 26.82,14.38 25.7,15.49 25.7,19.86 23.77,21.79 23.77,36.73 24.28,37.24 24.28,39.78 23.57,40.49 v23.27,40.49
  Bottom 0.203: U1.37 13.83,6.95 14.33,6.45 v14.73,6.45 | A1.35 19.66,42.98 20.02,42.62 | 20.02,42.62 20.83,41.81 21.95,41.81 v23.27,40.49 | 20.02,42.62 19.41,42.82
XBEE_RST  (via drill 0.3)
  Top 0.203: A1.15 2.54,18.9 2.54,16.41 2.08,15.95 2.08,7.42 3.15,6.35 7.47,6.35 7.82,5.99 9.35,5.99 10.41,4.93 12.39,4.93 12.9,5.44 v13.41,5.44
  Bottom 0.203: v13.41,5.44 13.03,5.82 U1.39
XBEE_RX  (via drill 0.3)
  Top 0.203: A1.14 2.54,21.44 2.54,19.56 2.03,19.05 2.03,16.61 1.63,16.2 1.63,7.16 2.85,5.94 7.16,5.94 7.67,5.44 v9.04,5.44
  Bottom 0.203: U1.47 9.83,6.43 9.04,5.64 v9.04,5.44
XBEE_TX  (via drill 0.3)
  Top 0.203: A1.13 2.54,23.98 2.54,22.1 2.08,21.64 2.08,19.81 1.52,19.25 1.52,16.82 1.17,16.46 1.17,6.91 2.54,5.54 6.81,5.54 7.62,4.72 v9.55,4.72 9.14,4.72
  Bottom 0.203: U1.46 10.23,6.12 9.91,5.79 9.91,5.08 v9.55,4.72

### Text on the board
tPlace: 0.3 | 0.2 | 0.1 | 0.0 | AGND | USER GPIO
bPlace: U1 | PSoC5 LP | TO BREAKOUT